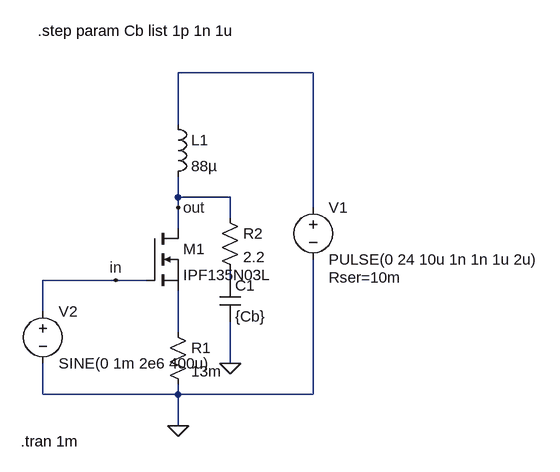
[diagram p0: schematic Draft1.asc]
Draft1.asc, the LTspice schematic file:
Version 4
SHEET 1 880 680
WIRE 336 -112 128 -112
WIRE 128 -32 128 -112
WIRE 128 80 128 48
WIRE 208 80 128 80
WIRE 128 96 128 80
WIRE 336 96 336 -112
WIRE 208 112 208 80
WIRE 128 128 128 96
WIRE 32 208 -80 208
WIRE 80 208 32 208
WIRE 208 208 208 192
WIRE -80 256 -80 208
WIRE 128 288 128 224
WIRE 208 336 208 272
WIRE -80 384 -80 336
WIRE 128 384 128 368
WIRE 128 384 -80 384
WIRE 336 384 336 176
WIRE 336 384 128 384
WIRE 128 432 128 384
FLAG 128 432 0
FLAG 128 96 out
FLAG 32 208 in
FLAG 208 336 0
SYMBOL nmos 80 128 R0
SYMATTR InstName M1
SYMATTR Value IPF135N03L
SYMBOL voltage 336 80 R0
WINDOW 123 0 0 Left 0
WINDOW 39 24 124 Left 2
SYMATTR InstName V1
SYMATTR Value PULSE(0 24 10u 1n 1n 1u 2u)
SYMATTR SpiceLine Rser=10m
SYMBOL voltage -80 240 R0
WINDOW 123 0 0 Left 0
WINDOW 39 0 0 Left 0
SYMATTR InstName V2
SYMATTR Value SINE(0 1m 2e6 400u)
SYMBOL res 112 272 R0
SYMATTR InstName R1
SYMATTR Value 13m
SYMBOL ind 112 -48 R0
SYMATTR InstName L1
SYMATTR Value 88µ
SYMATTR SpiceLine Rser=11m
SYMBOL cap 192 208 R0
SYMATTR InstName C1
SYMATTR Value {Cb}
SYMBOL res 192 96 R0
SYMATTR InstName R2
SYMATTR Value 2.2
TEXT -114 456 Left 2 !.tran 1m
TEXT -88 -176 Left 2 !.step param Cb list 1p 1n 1u

The netlist it stands for:
* Draft1.asc
M1 out in N003 N003 IPF135N03L
V1 N001 0 PULSE(0 24 10u 1n 1n 1u 2u) Rser=10m
V2 in 0 SINE(0 1m 2e6 400u)
R1 N003 0 13m
L1 N001 out 88µ Rser=11m
C1 N002 0 {Cb}
R2 out N002 2.2
.model NMOS NMOS
.model PMOS PMOS
.lib standard.mos
.tran 1m
.step param Cb list 1p 1n 1u
.backanno
.end